# Altium schematic sheet EPS_Distribution_Measurements.SchDoc: Distribution / Measurements
size A4; SheetNumber: 48; SheetTotal: 51
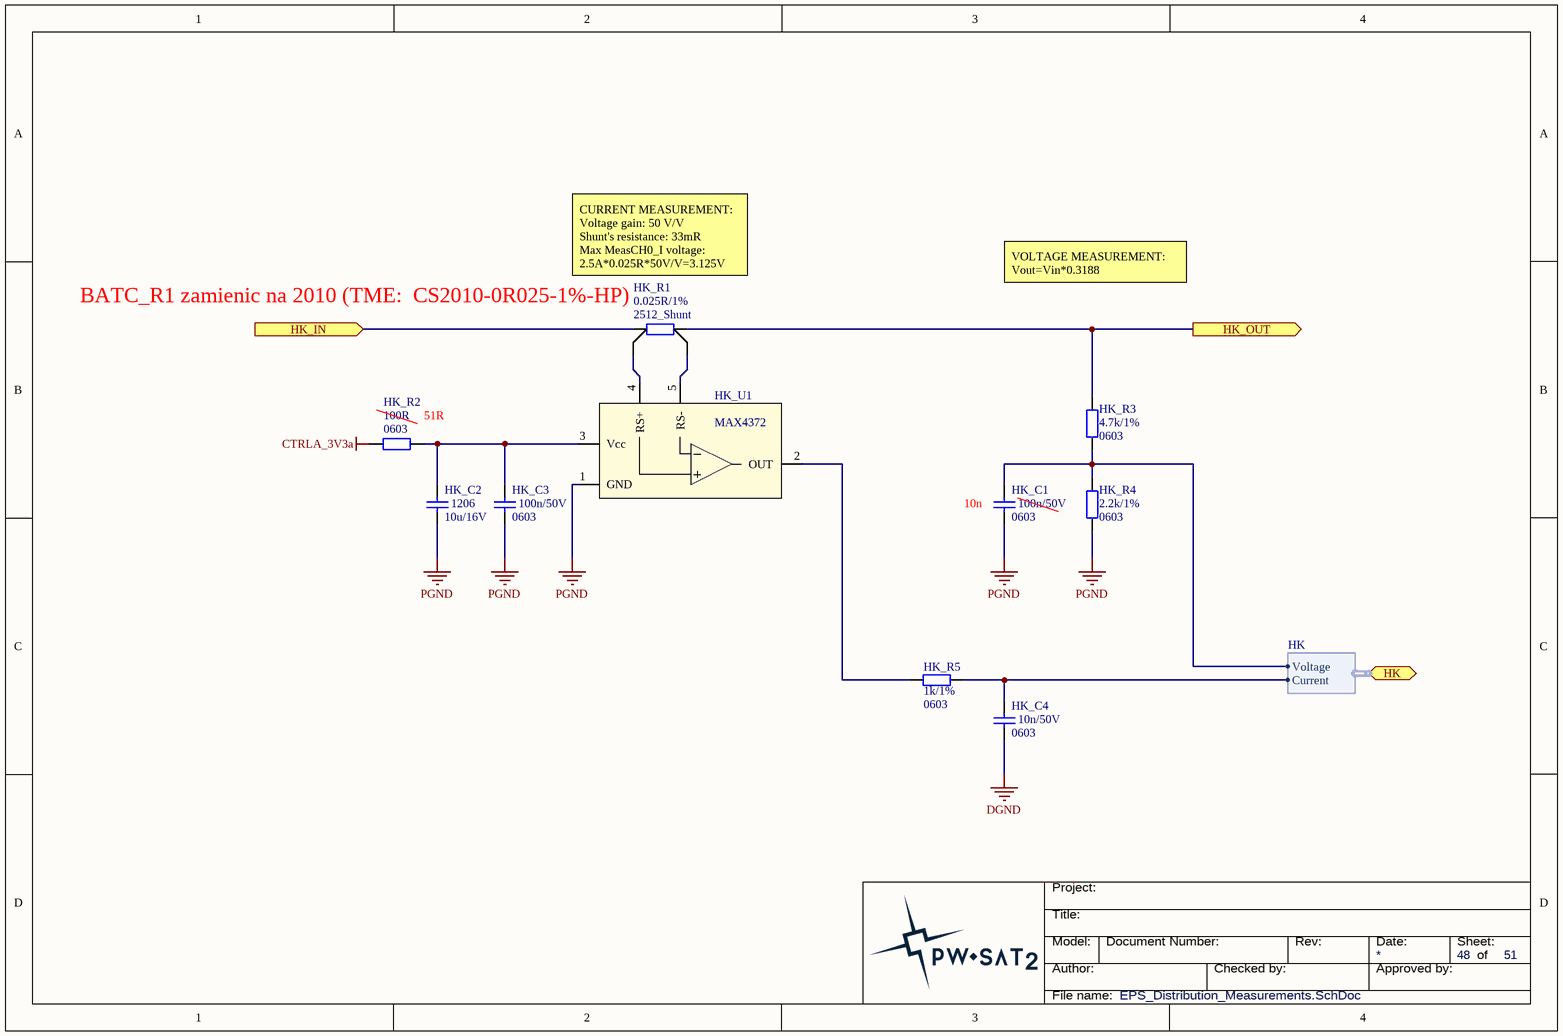
[diagram p0: EPS_Distribution_Measurements.SchDoc]

## Parts
HK_C1  Package: 0603  [SMD_Capacitor_0603]  (hidden comment: 100n/50V)
HK_C2  Packge: 1206  [SMD_Capacitor_1206]  (hidden comment: 10u/16V)
HK_C3  Package: 0603  [SMD_Capacitor_0603]  (hidden comment: 100n/50V)
HK_C4  Package: 0603  [SMD_Capacitor_0603]  (hidden comment: 10n/50V)
HK_R1  Package: 2512_Shunt  [SMD_Resistor-shunt_2512]  (hidden comment: 0.025R/1%)
HK_R2  Package: 0603  [SMD_Resistor_0603]  (hidden comment: 100R)
HK_R3  Package: 0603  [SMD_Resistor_0603]  (hidden comment: 4.7k/1%)
HK_R4  Package: 0603  [SMD_Resistor_0603]  (hidden comment: 2.2k/1%)
HK_R5  Package: 0603  [SMD_Resistor_0603]  (hidden comment: 1k/1%)
HK_U1  MAX4372  [SOT23-5]

## Ports
HK (harness HK), HK_IN (in), HK_OUT (out)

## Harnesses
HK: Voltage, Current

## Nets
CTRLA_3V3a: HK_R2.1
DGND: HK_C4.2
PGND: HK_C1.2 HK_C2.2 HK_C3.2 HK_R4.2 HK_U1.1(GND)
HK_IN: HK_R1.1 ; port HK_IN
HK_OUT: HK_R1.4 HK_R3.1 ; port HK_OUT
NetHK_C1_1: HK_C1.1 HK_R3.2 HK_R4.1 ; port HK.Voltage
NetHK_C2_1: HK_C2.1 HK_C3.1 HK_R2.2 HK_U1.3(Vcc)
NetHK_C4_1: HK_C4.1 HK_R5.2 ; port HK.Current
NetHK_R1_2: HK_R1.2 HK_U1.4(RS+)
NetHK_R1_3: HK_R1.3 HK_U1.5(RS-)
NetHK_R5_1: HK_R5.1 HK_U1.2(OUT)

## Notes on the sheet
- (near HK_R1) BATC_R1 zamienic na 2010 (TME:  CS2010-0R025-1%-HP)
- CURRENT MEASUREMENT:
  Voltage gain: 50 V/V
  Shunt's resistance: 33mR
  Max MeasCH0_I voltage: 2.5A*0.025R*50V/V=3.125V
- VOLTAGE MEASUREMENT:
  Vout=Vin*0.3188
- (near HK_R2) 51R
- (near HK_C1) 10n
- Title:
- Project:
- Author:
- Model:
- Document Number:
- Checked by:
- Rev:
- Date:
- Approved by:
- Sheet:
- of
- File name:

## Library data of the parts
HK_C1 HK_C3 HK_C4 = Cer_C0603T104K5RALTU: Ceramic Cap Kemet COTS 100n/50V X7R 0603; Manufacturer: Kemet; ManufacturerPartNumber: C0603T104K5RALTU
  HK_C1 HK_C3: Value: 100n/50V
  HK_C4: Value: 10n/50V
HK_C2 = Cer_C1206T106K4RACTU: Ceramic Cap Kemet COTS 10u/16V X7R 1206; ManufacturerPartNumber: C1206T106K4RACTU; Manufacturer: Kemet; Value: 10u/16V
HK_R1 = LR2512-R033FW: 33mR ,1%, 2W, shunt resistor, TE Connectivity.; ManufacturerPartNumber: LR2512-R033FW; Manufacturer: TE Connectivity; Power Rating: 2W; Value: 0.025R/1%
HK_R2-HK_R5 = Res
  HK_R2: Value: 100R
  HK_R3: Value: 4.7k/1%
  HK_R4: Value: 2.2k/1%
  HK_R5: Value: 1k/1%
HK_U1 = MAX4372: High-Side Current-Sense Amplifier with Voltage Output; Manufacturer: Maxim Integrated Products; Value: MAX4372